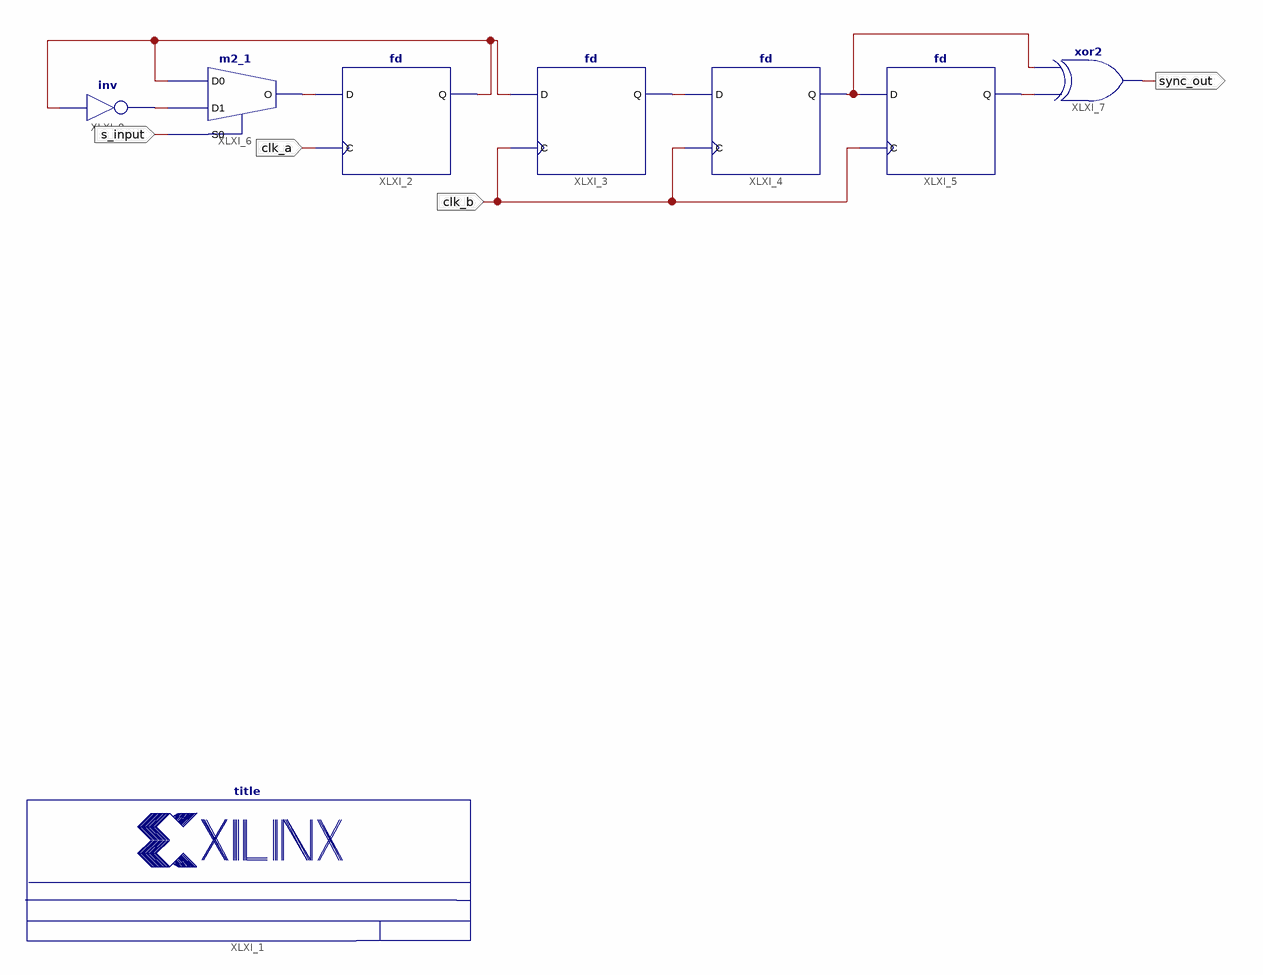
[diagram p0: schematic sheet 1]
// Xilinx ISE schematic TOGGLE_SYNCHRONIZER.sch (spartan3e) as structural Verilog: 8 symbols, 4 ports
module TOGGLE_SYNCHRONIZER (
  input  s_input,
  input  clk_a,
  input  clk_b,
  output sync_out
);

  wire XLXN_1, XLXN_3, XLXN_7, XLXN_10, XLXN_11, XLXN_12;

  title #(.NameFieldText("Karthik Vippala")) XLXI_1 ();
  fd XLXI_2 (.C(clk_a), .D(XLXN_1), .Q(XLXN_7));
  m2_1 XLXI_6 (.D0(XLXN_7), .D1(XLXN_3), .S0(s_input), .O(XLXN_1));
  not XLXI_8 (XLXN_3, XLXN_7);
  fd XLXI_3 (.C(clk_b), .D(XLXN_7), .Q(XLXN_10));
  fd XLXI_4 (.C(clk_b), .D(XLXN_10), .Q(XLXN_11));
  fd XLXI_5 (.C(clk_b), .D(XLXN_11), .Q(XLXN_12));
  xor XLXI_7 (sync_out, XLXN_12, XLXN_11);
endmodule
